# Altium schematic sheet Soldeerboute.SchDoc: Project ontwerpen soldeerbout
size A4; DrawnBy: Nino Bleus; Engineer: Nino Bleus; Revision: 1.0.0; SheetNumber: 2; SheetTotal: 4; Number: PXLEAI_20220001
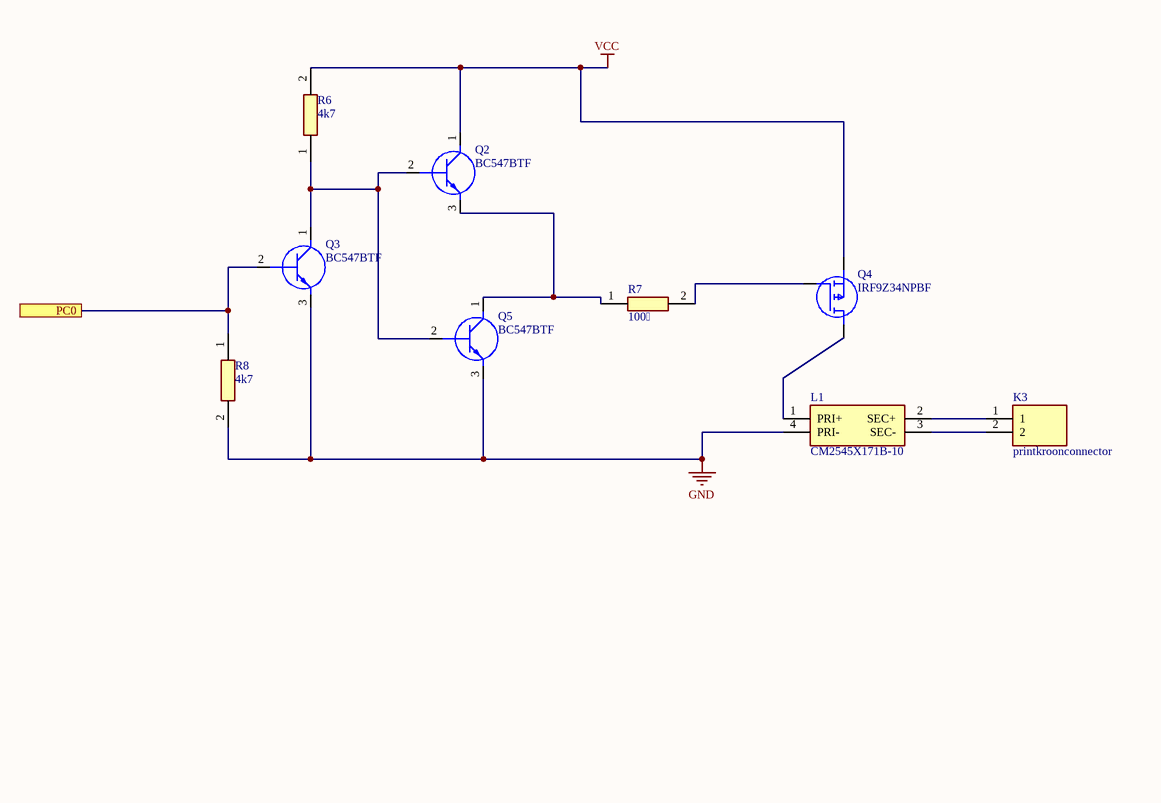
[diagram p0: Soldeerboute.SchDoc]

## Parts
K3  printkroonconnector  [1729128]
L1  CM2545X171B-10  [CM2545X171B10]
Q2  BC547BTF  [BC33740TA]
Q3  BC547BTF  [BC33740TA]
Q4  IRF9Z34NPBF  [TO254P469X1042X1967-3P]
Q5  BC547BTF  [BC33740TA]
R6  4k7  [RESC2012X65N]
R7  100  [RESC2012X65N]
R8  4k7  [RESC2012X65N]

## Ports
PC0

## Nets
GND: L1.4(PRI-) Q3.3(E) Q5.3(E) R8.2
VCC: Q2.1(C) Q4.2(S) R6.2
PC0: Q3.2(B) R8.1 ; port PC0
NetK3_1: K3.1 L1.2(SEC+)
NetK3_2: K3.2 L1.3(SEC-)
NetL1_1: L1.1(PRI+) Q4.3(D)
NetQ2_2: Q2.2(B) Q3.1(C) Q5.2(B) R6.1
NetQ2_3: Q2.3(E) Q5.1(C) R7.1
NetQ4_1: Q4.1(G) R7.2

## Library data of the parts
K3 = printkroonconnector: Connector; Manufacturer_Name: Phoenix Contact; Datasheet Link: http://www.phoenixcontact.com/de/produkte/1729128/pdf; Height: 10.15mm; Manufacturer_Part_Number: 1729128
L1 = CM2545X171B-10: Transformer; Manufacturer_Name: Laird Technologies; Datasheet Link: https://datasheet.datasheetarchive.com/originals/dk/DKDS-7/122753.pdf; Height: 9.5mm; Manufacturer_Part_Number: CM2545X171B-10
Q2 Q3 Q5 = BC547BTF: Transistor BJT NPN; Manufacturer_Name: ON Semiconductor; Datasheet Link: https://www.onsemi.com/pub/Collateral/BC550-D.pdf; Manufacturer_Part_Number: BC547BTF
Q4 = IRF9Z34NPBF: MOSFET (P-Channel); Manufacturer_Name: Infineon; Datasheet Link: https://componentsearchengine.com//IRF9Z34NPBF.pdf; Height: 4.69mm; Mouser2 Part Number: 942-IRF9Z34NPBF; Mouser2 Price/Stock: https://www.mouser.com/Search/Refine.aspx?Keyword=942-IRF9Z34NPBF; Manufacturer_Part_Number: IRF9Z34NPBF
R6-R8 = ESR10EZPJ183: Resistor; Manufacturer_Name: ROHM Semiconductor; Datasheet Link: https://datasheet.datasheetarchive.com/originals/distributors/Datasheets_SAMA/30ccb516c688c96e56c83a00b77a93f4.pdf; Height: 0.65mm; Manufacturer_Part_Number: ESR10EZPJ183